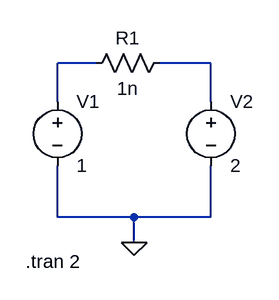
[diagram p0: schematic 1b.asc]
1b.asc, the LTspice schematic file:
Version 4.1
SHEET 1 880 680
WIRE 112 48 64 48
WIRE 256 48 192 48
WIRE 64 96 64 48
WIRE 256 96 256 48
WIRE 64 240 64 176
WIRE 160 240 64 240
WIRE 256 240 256 176
WIRE 256 240 160 240
WIRE 160 272 160 240
FLAG 160 272 0
SYMBOL voltage 64 80 R0
SYMATTR InstName V1
SYMATTR Value 1
SYMBOL voltage 256 80 R0
SYMATTR InstName V2
SYMATTR Value 2
SYMBOL res 208 32 R90
WINDOW 0 0 56 VBottom 2
WINDOW 3 32 56 VTop 2
SYMATTR InstName R1
SYMATTR Value 1n
TEXT 24 296 Left 2 !.tran 2

The netlist it stands for:
* 1b.asc
V1 N001 0 1
V2 N002 0 2
R1 N002 N001 1n
.tran 2
.backanno
.end